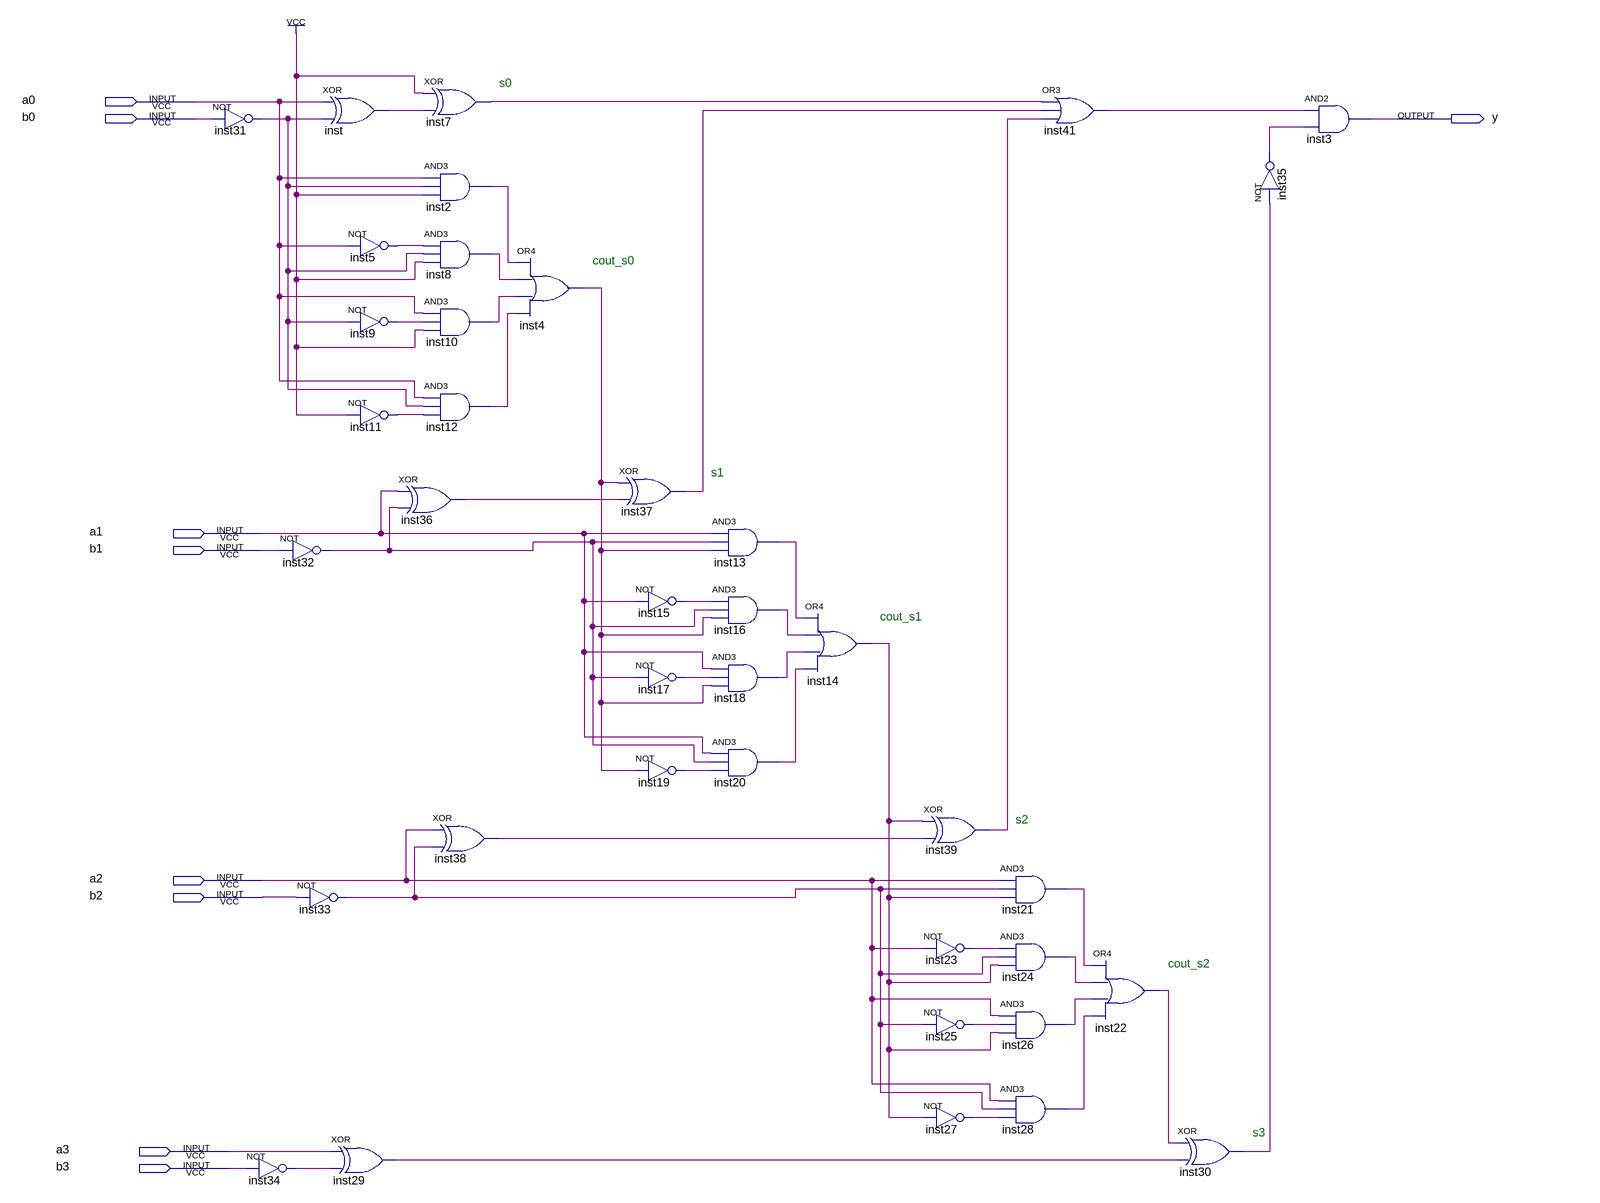
[diagram p0: schematic sheet]
// Quartus schematic strongmore.bdf as structural Verilog: 39 symbols, 9 pins
module strongmore (
  input  a0,
  input  b0,
  input  a1,
  input  b1,
  input  a2,
  input  b2,
  input  a3,
  input  b3,
  output y
);

  wire inst2_out, inst4_out, inst5_out, inst7_out, inst8_out, inst9_out, inst10_out, inst11_out, inst12_out,
       inst13_out, inst14_out, inst15_out, inst16_out, inst17_out, inst18_out, inst19_out, inst20_out,
       inst21_out, inst22_out, inst23_out, inst24_out, inst25_out, inst26_out, inst27_out, inst28_out,
       inst29_out, inst30_out, inst31_out, inst32_out, inst33_out, inst34_out, inst35_out, inst36_out,
       inst37_out, inst38_out, inst39_out, inst41_out, inst_out;

  not inst31 (inst31_out, b0);
  not inst34 (inst34_out, b3);
  not inst32 (inst32_out, b1);
  not inst33 (inst33_out, b2);
  xor inst (inst_out, a0, inst31_out);
  not inst5 (inst5_out, a0);
  not inst9 (inst9_out, inst31_out);
  not inst11 (inst11_out, 1'b1);
  xor inst29 (inst29_out, a3, inst34_out);
  xor inst7 (inst7_out, 1'b1, inst_out);
  and inst2 (inst2_out, a0, inst31_out, 1'b1);
  and inst8 (inst8_out, inst5_out, inst31_out, 1'b1);
  and inst10 (inst10_out, a0, inst9_out, 1'b1);
  and inst12 (inst12_out, a0, inst31_out, inst11_out);
  xor inst36 (inst36_out, a1, inst32_out);
  xor inst38 (inst38_out, a2, inst33_out);
  or inst4 (inst4_out, inst2_out, inst8_out, inst10_out, inst12_out);
  xor inst37 (inst37_out, inst4_out, inst36_out);
  not inst15 (inst15_out, a1);
  not inst17 (inst17_out, inst32_out);
  not inst19 (inst19_out, inst4_out);
  and inst13 (inst13_out, a1, inst32_out, inst4_out);
  and inst16 (inst16_out, inst15_out, inst32_out, inst4_out);
  and inst18 (inst18_out, a1, inst17_out, inst4_out);
  and inst20 (inst20_out, a1, inst32_out, inst19_out);
  or inst14 (inst14_out, inst13_out, inst16_out, inst18_out, inst20_out);
  xor inst39 (inst39_out, inst14_out, inst38_out);
  not inst23 (inst23_out, a2);
  not inst25 (inst25_out, inst33_out);
  not inst27 (inst27_out, inst14_out);
  or inst41 (inst41_out, inst7_out, inst37_out, inst39_out);
  and inst21 (inst21_out, a2, inst33_out, inst14_out);
  and inst24 (inst24_out, inst23_out, inst33_out, inst14_out);
  and inst26 (inst26_out, a2, inst25_out, inst14_out);
  and inst28 (inst28_out, a2, inst33_out, inst27_out);
  or inst22 (inst22_out, inst21_out, inst24_out, inst26_out, inst28_out);
  xor inst30 (inst30_out, inst22_out, inst29_out);
  not inst35 (inst35_out, inst30_out);
  and inst3 (y, inst41_out, inst35_out);

  // Notes on the sheet:
  //   s0
  //   cout_s0
  //   s1
  //   cout_s1
  //   s2
  //   cout_s2
  //   s3
endmodule
